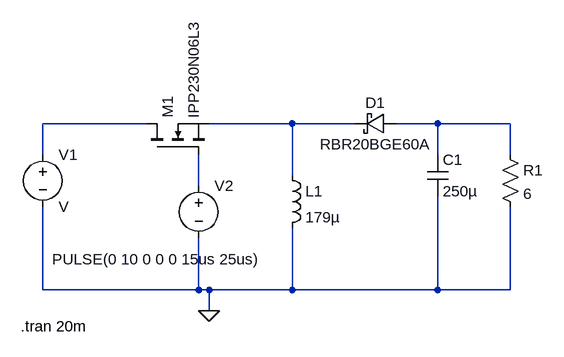
[diagram p0: schematic 2_buck_boost.asc]
2_buck_boost.asc, the LTspice schematic file:
Version 4
SHEET 1 880 736
WIRE 128 80 -32 80
WIRE 352 80 224 80
WIRE 448 80 352 80
WIRE 576 80 512 80
WIRE 688 80 576 80
WIRE -32 128 -32 80
WIRE 576 128 576 80
WIRE 688 128 688 80
WIRE 352 160 352 80
WIRE 208 176 208 128
WIRE -32 336 -32 208
WIRE 208 336 208 256
WIRE 208 336 -32 336
WIRE 224 336 208 336
WIRE 352 336 352 240
WIRE 352 336 224 336
WIRE 576 336 576 192
WIRE 576 336 352 336
WIRE 688 336 688 208
WIRE 688 336 576 336
WIRE 224 368 224 336
FLAG 224 368 0
SYMBOL nmos 128 128 R270
SYMATTR InstName M1
SYMATTR Value IPP230N06L3
SYMBOL schottky 512 64 R90
WINDOW 0 0 32 VBottom 2
WINDOW 3 32 32 VTop 2
SYMATTR InstName D1
SYMATTR Value RBR20BGE60A
SYMATTR Description Diode
SYMATTR Type diode
SYMBOL ind 336 144 R0
SYMATTR InstName L1
SYMATTR Value 179µ
SYMBOL cap 560 128 R0
SYMATTR InstName C1
SYMATTR Value 250µ
SYMBOL res 672 112 R0
SYMATTR InstName R1
SYMATTR Value 6
SYMBOL voltage 208 160 R0
WINDOW 3 -226 129 Left 2
WINDOW 123 0 0 Left 0
WINDOW 39 0 0 Left 0
SYMATTR InstName V2
SYMATTR Value PULSE(0 10 0 0 0 15us 25us)
SYMBOL voltage -32 112 R0
SYMATTR InstName V1
TEXT -66 392 Left 2 !.tran 20m

The netlist it stands for:
* 2_buck_boost.asc
M1 N001 N004 N002 N002 IPP230N06L3
D1 N003 N002 RBR20BGE60A
L1 N002 0 179µ
C1 N003 0 250µ
R1 N003 0 6
V2 N004 0 PULSE(0 10 0 0 0 15us 25us)
V1 N001 0 V
.model D D
.lib standard.dio
.model NMOS NMOS
.model PMOS PMOS
.lib standard.mos
.tran 20m
.backanno
.end